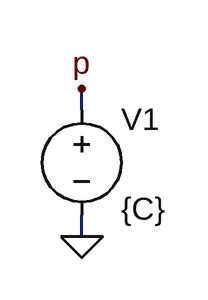
[diagram p0: schematic ConstSch.asc]
ConstSch.asc, the LTspice schematic file:
Version 4
SHEET 1 880 680
WIRE 160 128 160 112
WIRE 160 224 160 208
FLAG 160 224 0
FLAG 160 112 p
SYMBOL voltage 160 112 R0
WINDOW 0 30 23 Left 0
WINDOW 3 30 91 Left 0
SYMATTR InstName V1
SYMATTR Value {C}

The netlist it stands for:
* ConstSch.asc
V1 p 0 {C}
.backanno
.end